# Altium schematic sheet Lan.SchDoc
size A3
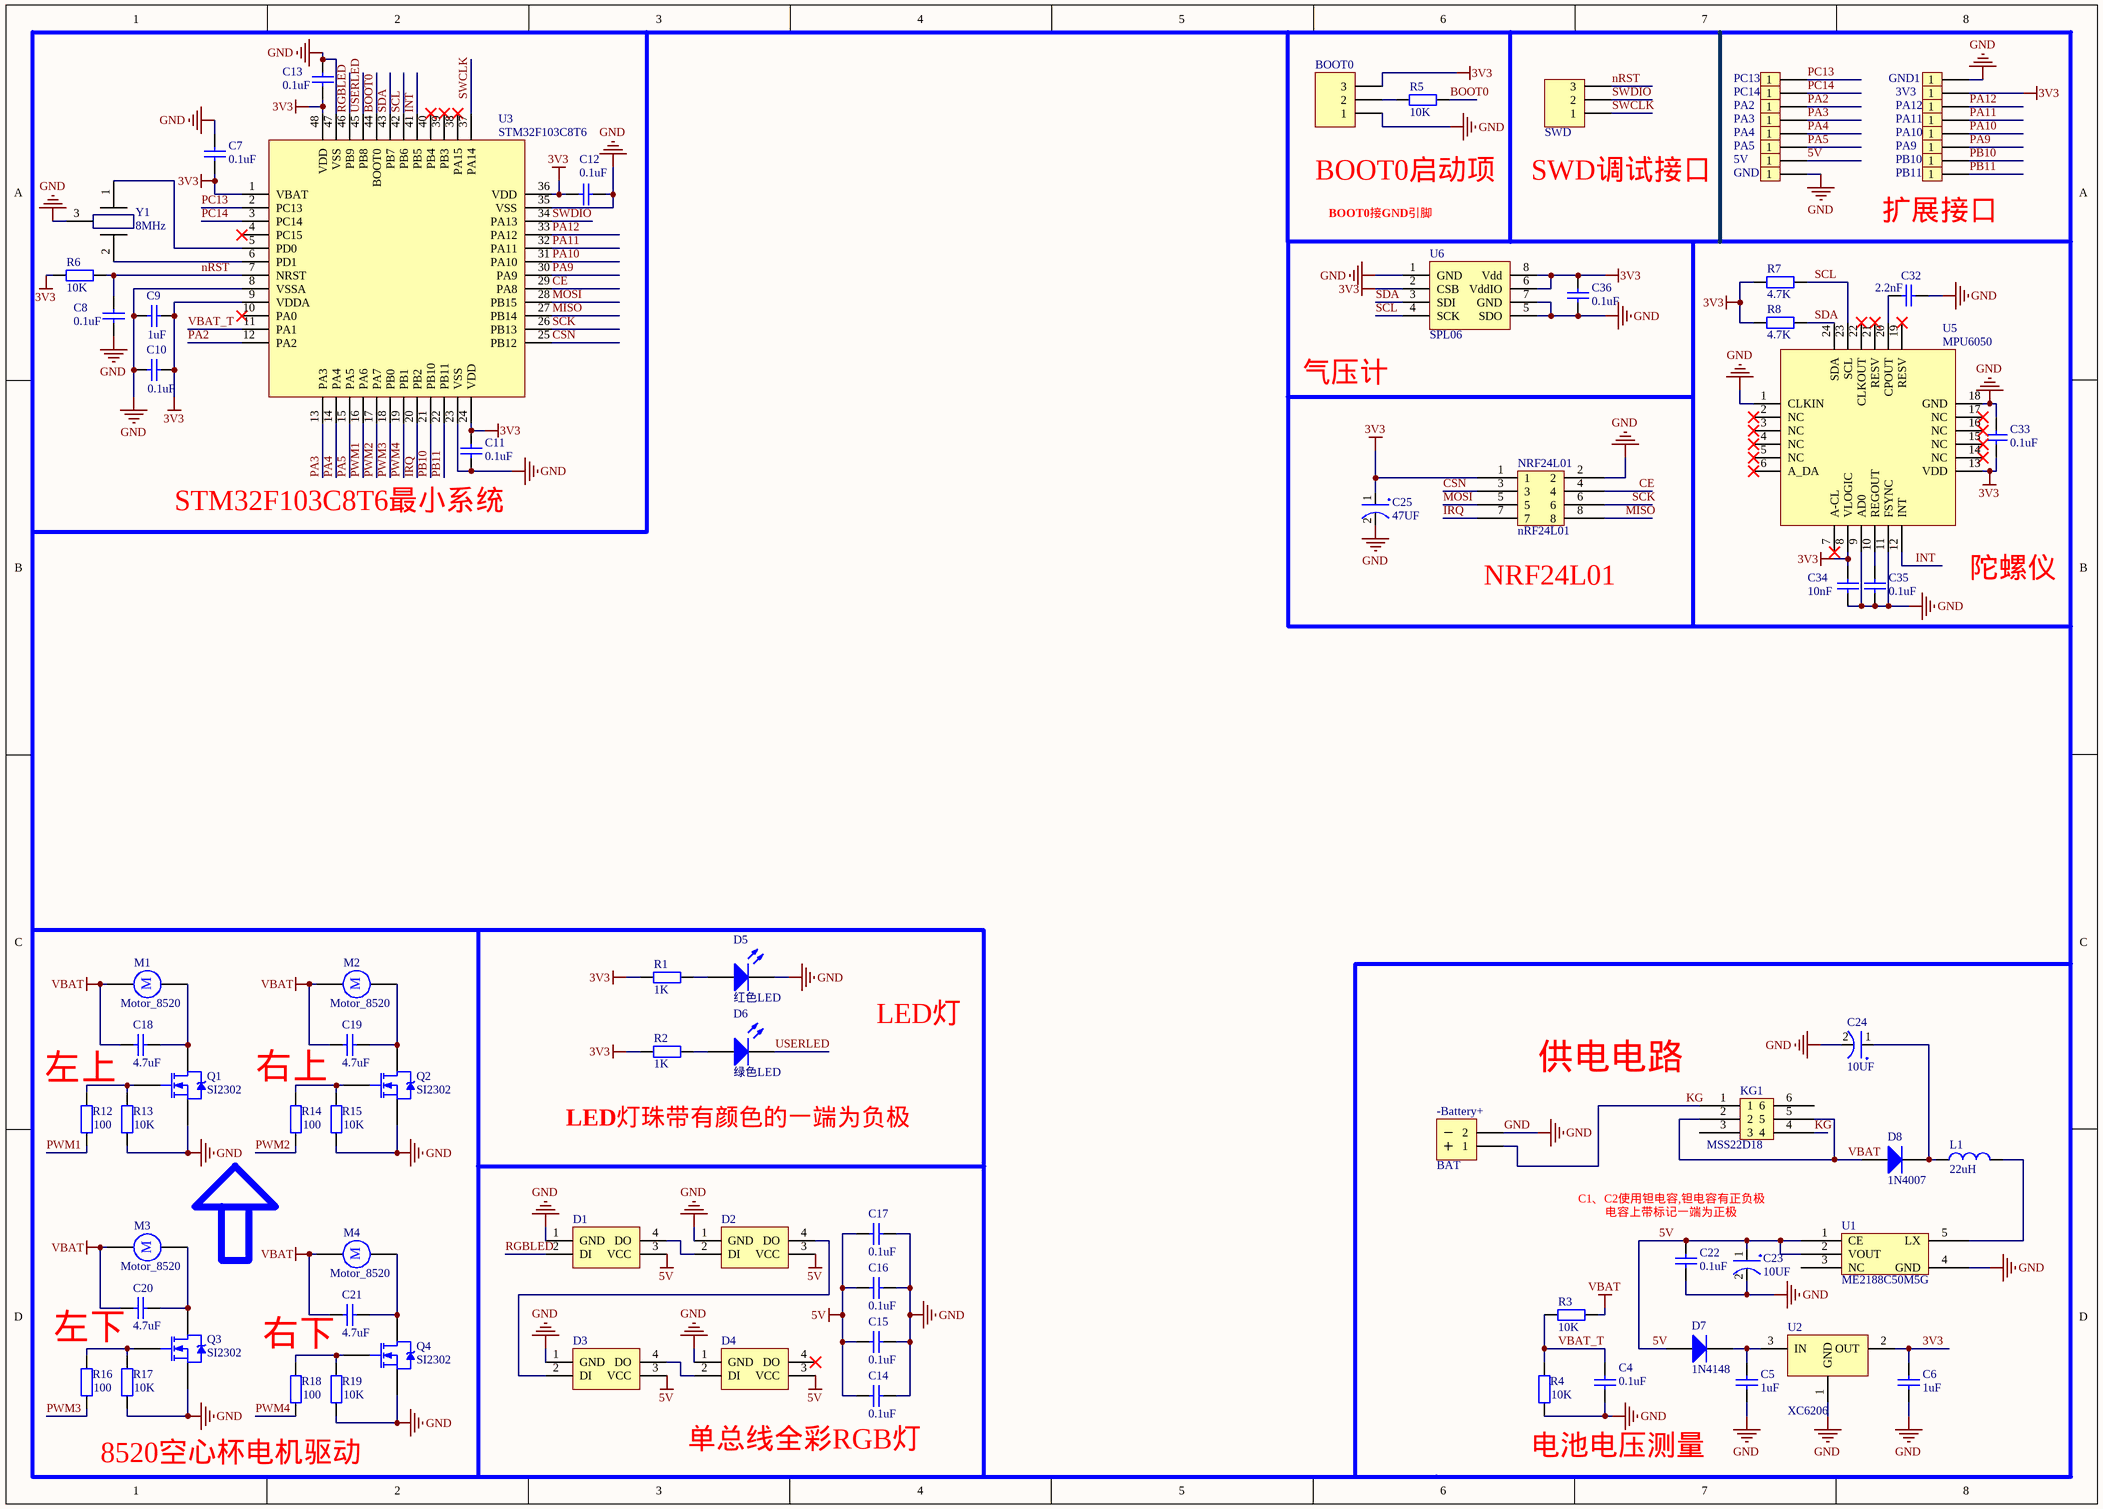
[diagram p0: Lan.SchDoc]

## Parts
3V3  Header 1  [HEADER1]  (value not drawn)
5V  Header 1  [HEADER1]  (value not drawn)
-Battery+  BAT  [BAT]
BOOT0  BOOT  [HEADER1X3]  (value not drawn)
C4  0.1uF  [C_0603]
C5  1uF  [C_0603]
C6  1uF  [C_0603]
C7  0.1uF  [C_0603]
C8  0.1uF  [C_0603]
C9  1uF  [C_0603]
C10  0.1uF  [C_0603]
C11  0.1uF  [C_0603]
C12  0.1uF  [C_0603]
C13  0.1uF  [C_0603]
C14  0.1uF  [C_0603]
C15  0.1uF  [C_0603]
C16  0.1uF  [C_0603]
C17  0.1uF  [C_0603]
C18  4.7uF  [C_0603]
C19  4.7uF  [C_0603]
C20  4.7uF  [C_0603]
C21  4.7uF  [C_0603]
C22  0.1uF  [C_0603]
C23  10UF  [capacity]
C24  10UF  [capacity]
C25  47UF  [capacity]
C32  2.2nF  [C_0603]
C33  0.1uF  [C_0603]
C34  10nF  [C_0603]
C35  0.1uF  [C_0603]
C36  0.1uF  [C_0603]
D1  WS2812B  [RGB_LED_5050]  (value not drawn)
D2  WS2812B  [RGB_LED_5050]  (value not drawn)
D3  WS2812B  [RGB_LED_5050]  (value not drawn)
D4  WS2812B  [RGB_LED_5050]  (value not drawn)
D5  红色LED  [LED-0603]
D6  绿色LED  [LED-0603]
D7  1N4148  [SOD-123]
D8  1N4007  [SMA]
GND  Header 1  [HEADER1]  (value not drawn)
GND1  Header 1  [HEADER1]  (value not drawn)
KG1  MSS22D18  [MSS22D18]
L1  22uH  [22uH]
M1  Motor_8520  [MOTOR]
M2  Motor_8520  [MOTOR]
M3  Motor_8520  [MOTOR]
M4  Motor_8520  [MOTOR]
NRF24L01  nRF24L01  [NRF24L01]
PA2  Header 1  [HEADER1]  (value not drawn)
PA3  Header 1  [HEADER1]  (value not drawn)
PA4  Header 1  [HEADER1]  (value not drawn)
PA5  Header 1  [HEADER1]  (value not drawn)
PA9  Header 1  [HEADER1]  (value not drawn)
PA10  Header 1  [HEADER1]  (value not drawn)
PA11  Header 1  [HEADER1]  (value not drawn)
PA12  Header 1  [HEADER1]  (value not drawn)
PB10  Header 1  [HEADER1]  (value not drawn)
PB11  Header 1  [HEADER1]  (value not drawn)
PC13  Header 1  [HEADER1]  (value not drawn)
PC14  Header 1  [HEADER1]  (value not drawn)
Q1  SI2302  [SOT-23(SOT-23-3)]
Q2  SI2302  [SOT-23(SOT-23-3)]
Q3  SI2302  [SOT-23(SOT-23-3)]
Q4  SI2302  [SOT-23(SOT-23-3)]
R1  1K  [R_0603]
R2  1K  [R_0603]
R3  10K  [R_0603]
R4  10K  [R_0603]
R5  10K  [R_0603]
R6  10K  [R_0603]
R7  4.7K  [R_0603]
R8  4.7K  [R_0603]
R12  100  [R_0603]
R13  10K  [R_0603]
R14  100  [R_0603]
R15  10K  [R_0603]
R16  100  [R_0603]
R17  10K  [R_0603]
R18  100  [R_0603]
R19  10K  [R_0603]
SWD  SWD  [SH1_0X5P_WT]  (value not drawn)
U1  ME2188C50M5G  [ME2188C50M5G]
U2  XC6206  [SOT-23(SOT-23-3)]
U3  STM32F103C8T6  [LQFP-48_7x7x05P]
U5  MPU6050  [QFN-24_4x4x05P]
U6  SPL06  [LGA-2_5X2MM]
Y1  value 8MHz  [SMD-CSTSE800G52-R0]  (hidden comment: XTAL)

## Nets
3V3: 3V3.1 BOOT0.3 C6.1 C7.2 C9.2 C10.2 C11.1 C12.2 C13.1 C25.1 C33.2 C34.2 C36.1 NRF24L01.1 R1.1 R2.1 R6.2 R7.1 R8.1 U2.2(OUT) U3.1(VBAT) U3.9(VDDA) U3.24(VDD) U3.36(VDD) U3.48(VDD) U5.8(VLOGIC) U5.13(VDD) U6.2(CSB) U6.6(VddIO) U6.8(Vdd)
5V: 5V.1 C14.2 C15.2 C16.2 C17.2 C22.1 C23.1 D1.3(VCC) D2.3(VCC) D3.3(VCC) D4.3(VCC) D7.1(A) U1.1(CE) U1.2(VOUT)
GND: -Battery+.2 BOOT0.1 C4.1 C5.2 C6.2 C7.1 C8.1 C9.1 C10.1 C11.2 C12.1 C13.2 C14.1 C15.1 C16.1 C17.1 C22.2 C23.2 C24.2 C25.2 C32.1 C33.1 C34.1 C35.2 C36.2 D1.1(GND) D2.1(GND) D3.1(GND) D4.1(GND) D5.2 GND.1 GND1.1 NRF24L01.2 Q1.2(S) Q2.2(S) Q3.2(S) Q4.2(S) R4.1 R13.1 R15.1 R17.1 R19.1 U1.4(GND) U2.1(GND) U3.8(VSSA) U3.23(VSS) U3.35(VSS) U3.47(VSS) U5.1(CLKIN) U5.9(AD0) U5.11(FSYNC) U5.18(GND) U6.1(GND) U6.5(SDO) U6.7(GND) Y1.3
VBAT: C18.2 C19.2 C20.2 C21.2 D8.1(A) KG1.2 KG1.5 M1.1 M2.1 M3.1 M4.1 R3.2
BOOT0: R5.2 U3.44(BOOT0)
CE: NRF24L01.4 U3.29(PA8)
CSN: NRF24L01.3 U3.25(PB12)
INT: U3.41(PB5) U5.12(INT)
IRQ: NRF24L01.7 U3.20(PB2)
KG: -Battery+.1 KG1.1 KG1.4
MISO: NRF24L01.8 U3.27(PB14)
MOSI: NRF24L01.5 U3.28(PB15)
nRST: C8.2 R6.1 SWD.3 U3.7(NRST)
PA2: PA2.1 U3.12(PA2)
PA3: PA3.1 U3.13(PA3)
PA4: PA4.1 U3.14(PA4)
PA5: PA5.1 U3.15(PA5)
PA9: PA9.1 U3.30(PA9)
PA10: PA10.1 U3.31(PA10)
PA11: PA11.1 U3.32(PA11)
PA12: PA12.1 U3.33(PA12)
PB10: PB10.1 U3.21(PB10)
PB11: PB11.1 U3.22(PB11)
PC13: PC13.1 U3.2(PC13)
PC14: PC14.1 U3.3(PC14)
PWM1: R12.1 U3.16(PA6)
PWM2: R14.1 U3.17(PA7)
PWM3: R16.1 U3.18(PB0)
PWM4: R18.1 U3.19(PB1)
RGBLED: D1.2(DI) U3.46(PB9)
SCK: NRF24L01.6 U3.26(PB13)
SCL: R7.2 U3.42(PB6) U5.23(SCL) U6.4(SCK)
SDA: R8.2 U3.43(PB7) U5.24(SDA) U6.3(SDI)
SWCLK: SWD.1 U3.37(PA14)
SWDIO: SWD.2 U3.34(PA13)
USERLED: D6.2 U3.45(PB8)
VBAT_T: C4.2 R3.1 R4.2 U3.11(PA1)
NetBOOT0_2: BOOT0.2 R5.1
NetC5_1: C5.1 D7.2(K) U2.3(IN)
NetC18_1: C18.1 M1.2 Q1.3(D)
NetC19_1: C19.1 M2.2 Q2.3(D)
NetC20_1: C20.1 M3.2 Q3.3(D)
NetC21_1: C21.1 M4.2 Q4.3(D)
NetC24_1: C24.1 D8.2(K) L1.1
NetC32_2: C32.2 U5.20(CPOUT)
NetC35_1: C35.1 U5.10(REGOUT)
NetD1_4: D1.4(DO) D2.2(DI)
NetD2_4: D2.4(DO) D3.2(DI)
NetD3_4: D3.4(DO) D4.2(DI)
NetD5_1: D5.1 R1.2
NetD6_1: D6.1 R2.2
NetL1_2: L1.2 U1.5(LX)
NetQ1_1: Q1.1(G) R12.2 R13.2
NetQ2_1: Q2.1(G) R14.2 R15.2
NetQ3_1: Q3.1(G) R16.2 R17.2
NetQ4_1: Q4.1(G) R18.2 R19.2
NetU3_5: U3.5(PD0) Y1.1
NetU3_6: U3.6(PD1) Y1.2

Not connected (* = marked no-connect by the designer): D4 4(DO)*; KG1 3 6; U1 3(NC); U3 4(PC15)* 10(PA0)* 38(PA15)* 39(PB3)* 40(PB4)*; U5 2(NC)* 3(NC)* 4(NC)* 5(NC)* 6(A_DA)* 7(A-CL)* 14(NC)* 15(NC)* 16(NC)* 17(NC)* 19(RESV)* 21(RESV)* 22(CLKOUT)*

## Notes on the sheet
- BOOT0启动项
- (near SWD) SWD调试接口
- BOOT0接GND引脚
- 扩展接口
- 气压计
- STM32F103C8T6最小系统
- (near NRF24L01) NRF24L01
- (near U5) 陀螺仪
- LED灯
- (near R12) 左上
- (near R14) 右上
- LED灯珠带有颜色的一端为负极
- 供电电路
- (near C22) C1、C2使用钽电容,钽电容有正负极
- (near C22) 电容上带标记一端为正极
- (near R16) 左下
- (near R18) 右下
- 单总线全彩RGB灯
- 电池电压测量
- 8520空心杯电机驱动
- (in symbol Motor_720) M

## Library data of the parts
3V3 5V GND GND1 PA2-PA5 PA9-PA12 PB10 PB11 PC13 PC14 = Header 1: 单排针; LatestRevisionDate: 17-Jul-2002; LatestRevisionNote: Re-released for DXP Platform.; Publisher: Altium Limited
-Battery+ = BAT: 两脚排针; Publisher: mazhongwei; Published: 8-August-2017; PackageReference: HDR1X2
BOOT0 = Header 3: 三脚排针; LatestRevisionDate: 17-Jul-2002; LatestRevisionNote: Re-released for DXP Platform.; Publisher: Altium Limited
C4-C22 C32-C36 = C_0603: 0603贴片电容; Published: 8-Jun-2000; LatestRevisionDate: 17-Jul-2002; LatestRevisionNote: Re-released for DXP Platform.; PackageReference: RAD-0.3; Publisher: Altium Limited; PackageDescription: Radial Cap, Thru-Hole; 2 Leads; 0.3 in Pin Spacing
  C4 C7 C8 C10-C17 C22 C33 C35 C36: Value: 0.1uF
  C5 C6 C9: Value: 1uF
  C18-C21: Value: 4.7uF
  C32: Value: 2.2nF
  C34: Value: 10nF
C23-C25 = capacity: 3216钽电容
D1-D4 = P923D: 单总线全彩RGB灯; Publisher: mazhongwei; Published: 8-August-2017; PackageReference: RGB_LED_5050
D5 D6 = LED 0603: 发光二极管; Published: 8-Jun-2000; LatestRevisionDate: 08-Jul-2005; LatestRevisionNote: Mech Layer 1 removed.; PackageReference: LED-0; Publisher: Altium Limited; PackageDescription: LED; 2 Leads
D7 D8 = Diode: Default Diode; Published: 8-August-2017; PackageReference: DO214AC; Publisher: mazhongwei
KG1 = MSS22D18: 拨动开关
L1 = Inductor: 电感; Code_IEC: 1005; Published: 8-Jun-2000; LatestRevisionDate: 17-Jul-2002; LatestRevisionNote: Re-released for DXP Platform.; PackageReference: 0402-A; Publisher: Altium Limited; Code_JEITA: 0402; Value: 22uH
M1-M4 = Motor_720: Motor, General Kind; Published: 8-August-2017; PackageReference: RB5-10.5; Publisher: mazhongwei
NRF24L01 = nRF24L01: 2.4G模块
Q1-Q4 = SI2302: N-Channel Power MOSFET; Published: 8-August-2017; PackageReference: SOT23-3; Publisher: mazhongwei
R1-R8 R12-R19 = R_0603: 0603贴片电阻; Published: 8-Jun-2000; LatestRevisionDate: 17-Jul-2002; LatestRevisionNote: Re-released for DXP Platform.; PackageReference: AXIAL-0.4; Publisher: Altium Limited; PackageDescription: Axial Device, Thru-Hole; 2 Leads; 0.4 in Pin Spacing
  R1 R2: Value: 1K
  R3-R6 R13 R15 R17 R19: Value: 10K
  R7 R8: Value: 4.7K
  R12 R14 R16 R18: Value: 100
SWD = SWD: 三脚排针; LatestRevisionDate: 17-Jul-2002; LatestRevisionNote: Re-released for DXP Platform.; Publisher: Altium Limited
U1 = ME2188C50M5G: 升压IC
U2 = XC6206: 稳压LDO; PackageReference: SOT23-3; Published: 12-August-2017; Publisher: mazhongwei
U5 = MPU6050: 陀螺仪
U6 = FBM320: 气压计; Published: 8-August-2017; Publisher: mazhongwei; PackageReference: LGA-2_5X2MM
Y1 = XTAL_2: 贴片8MHZ晶振; Publisher: mazhongwei; Published: 8-August-2017; PackageReference: SMD-cstse800G52-r0